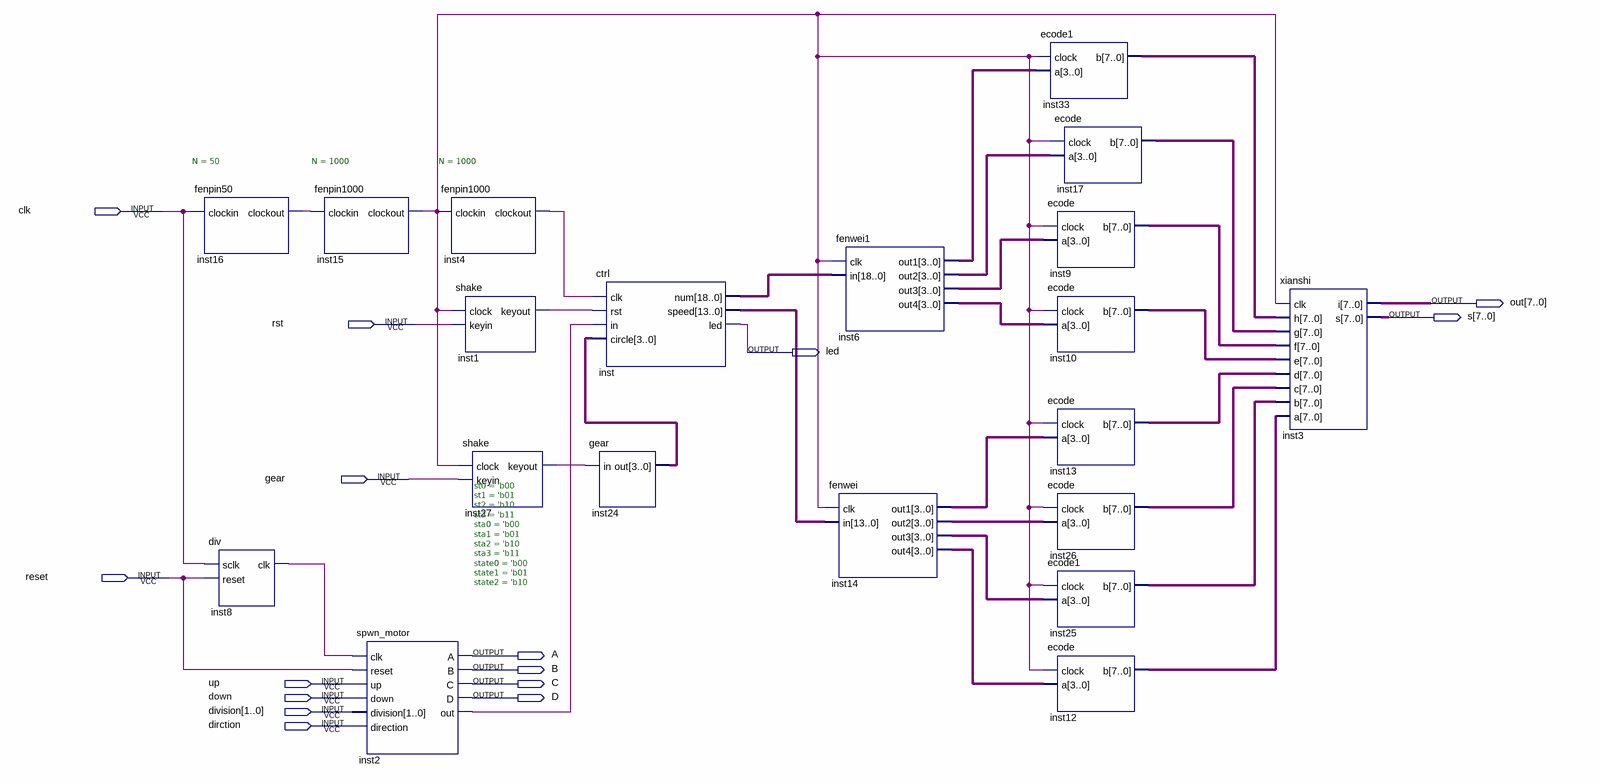
[diagram p0: schematic sheet]
// Quartus schematic Block1.bdf as structural Verilog: 20 symbols, 15 pins
module Block1 (
  input  clk,
  input  rst,
  input  gear,
  input  reset,
  input  up,
  input  down,
  input  [1:0] division,
  input  dirction,
  output [7:0] out,
  output [7:0] s,
  output led,
  output A,
  output B,
  output C,
  output D
);

  wire inst1_keyout, inst2_out, inst4_clockout, inst8_clk, inst15_clockout, inst16_clockout, inst27_keyout;
  wire [3:0] inst6_out1, inst6_out2, inst6_out3, inst6_out4, inst14_out1, inst14_out2, inst14_out3,
       inst14_out4, inst24_out;
  wire [7:0] inst9_b, inst10_b, inst12_b, inst13_b, inst17_b, inst25_b, inst26_b, inst33_b;
  wire [13:0] inst_speed;
  wire [18:0] inst_num;

  fenpin50 #(.N(50)) inst16 (.clockin(clk), .clockout(inst16_clockout));
  div inst8 (.sclk(clk), .reset(reset), .clk(inst8_clk));
  fenpin1000 #(.N(1000)) inst15 (.clockin(inst16_clockout), .clockout(inst15_clockout));
  spwn_motor #(.st0('b00), .st1('b01), .st2('b10), .st3('b11), .sta0('b00), .sta1('b01), .sta2('b10), .sta3('b11), .state0('b00), .state1('b01), .state2('b10)) inst2 (
    .clk(inst8_clk), .reset(reset), .up(up), .down(down), .division(division), .direction(dirction), .A(A),
    .B(B), .C(C), .D(D), .out(inst2_out));
  fenpin1000 #(.N(1000)) inst4 (.clockin(inst15_clockout), .clockout(inst4_clockout));
  shake inst1 (.clock(inst15_clockout), .keyin(rst), .keyout(inst1_keyout));
  shake inst27 (.clock(inst15_clockout), .keyin(gear), .keyout(inst27_keyout));
  ctrl inst (
    .clk(inst4_clockout), .rst(inst1_keyout), .in(inst2_out), .circle(inst24_out), .num(inst_num),
    .speed(inst_speed), .led(led));
  gear inst24 (.in(inst27_keyout), .out(inst24_out));
  fenwei1 inst6 (
    .clk(inst15_clockout), .in(inst_num), .out1(inst6_out1), .out2(inst6_out2), .out3(inst6_out3),
    .out4(inst6_out4));
  fenwei inst14 (
    .clk(inst15_clockout), .in(inst_speed), .out1(inst14_out1), .out2(inst14_out2), .out3(inst14_out3),
    .out4(inst14_out4));
  ecode1 inst33 (.clock(inst15_clockout), .a(inst6_out1), .b(inst33_b));
  ecode inst17 (.clock(inst15_clockout), .a(inst6_out2), .b(inst17_b));
  ecode inst9 (.clock(inst15_clockout), .a(inst6_out3), .b(inst9_b));
  ecode inst10 (.clock(inst15_clockout), .a(inst6_out4), .b(inst10_b));
  ecode inst13 (.clock(inst15_clockout), .a(inst14_out1), .b(inst13_b));
  ecode inst26 (.clock(inst15_clockout), .a(inst14_out2), .b(inst26_b));
  ecode1 inst25 (.clock(inst15_clockout), .a(inst14_out3), .b(inst25_b));
  ecode inst12 (.clock(inst15_clockout), .a(inst14_out4), .b(inst12_b));
  xianshi inst3 (
    .clk(inst15_clockout), .h(inst33_b), .g(inst17_b), .f(inst9_b), .e(inst10_b), .d(inst13_b), .c(inst26_b),
    .b(inst25_b), .a(inst12_b), .i(out), .s(s));
endmodule
